# EAGLE schematic working (EAGLE 7.7.0)
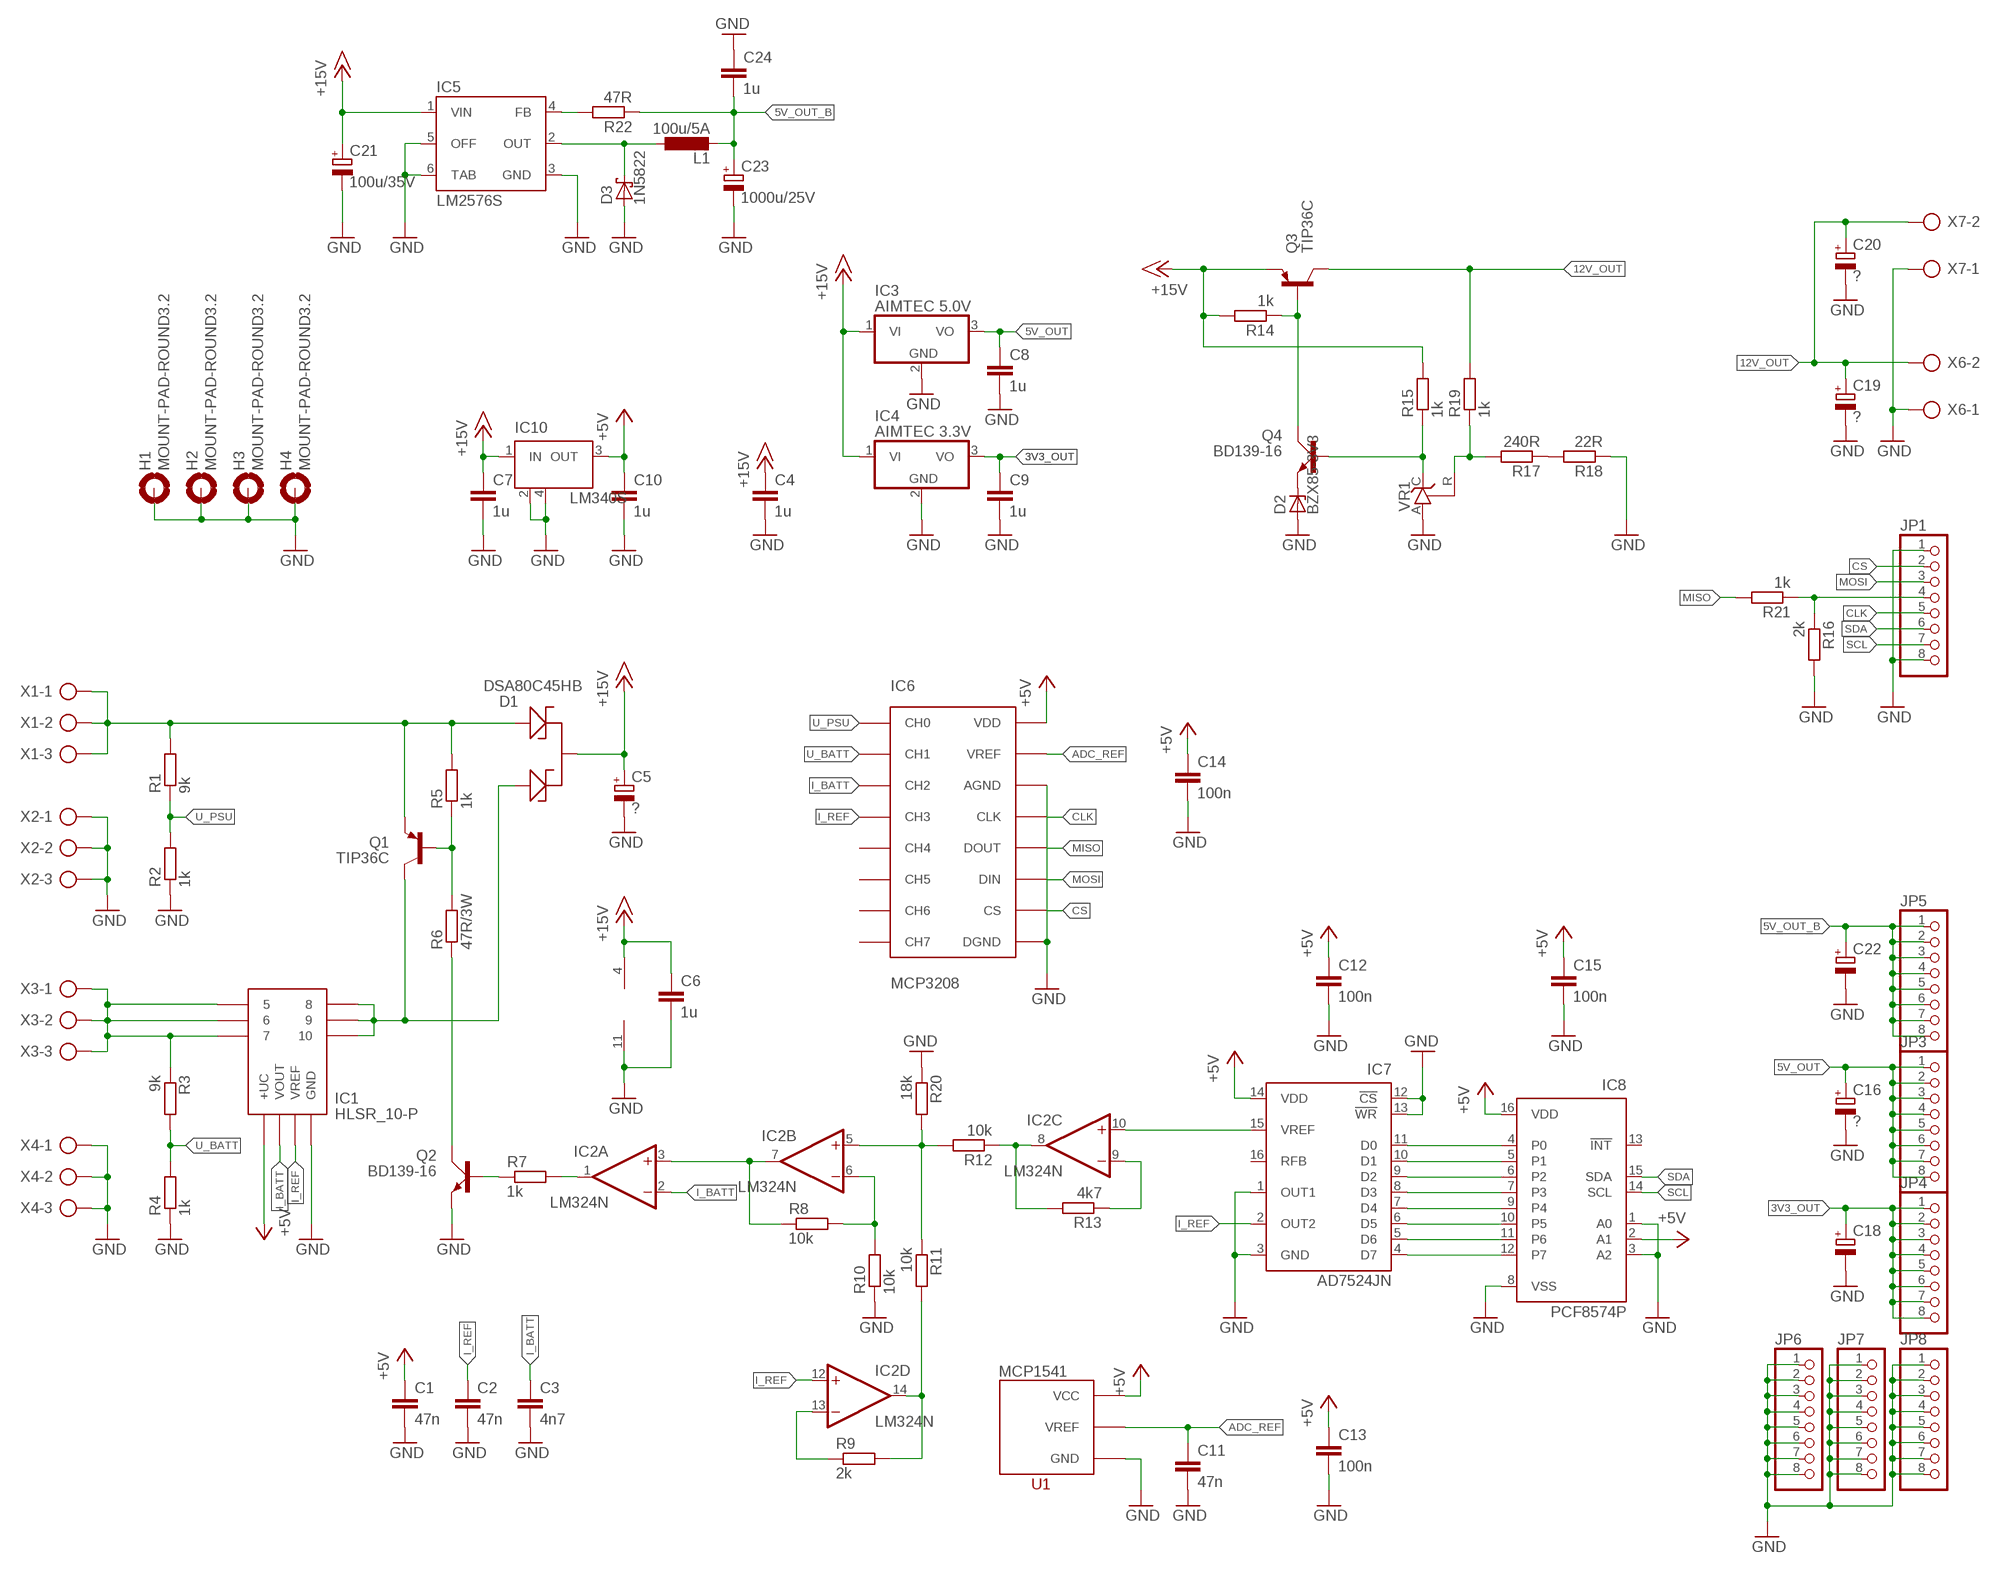
[diagram p0: schematic, sheet 1]

## Parts
C1  47n  C-EUC0805  [C0805]
C2  47n  C-EUC0805  [C0805]
C3  4n7  C-EUC0805  [C0805]
C4  1u  C-EUC0805  [C0805]
C5  ?  CPOL-EUE5-13  [E5-13]
C6  1u  C-EUC0805  [C0805]
C7  1u  C-EUC0805  [C0805]
C8  1u  C-EUC0805  [C0805]
C9  1u  C-EUC0805  [C0805]
C10  1u  C-EUC0805  [C0805]
C11  47n  C-EUC0805  [C0805]
C12  100n  C-EUC0805  [C0805]
C13  100n  C-EUC0805  [C0805]
C14  100n  C-EUC0805  [C0805]
C15  100n  C-EUC0805  [C0805]
C16  ?  CPOL-EUE2.5-6  [E2,5-6]
C18  CPOL-EUE2.5-6  [E2,5-6]
C19  ?  CPOL-EUE5-13  [E5-13]
C20  ?  CPOL-EUE5-13  [E5-13]
C21  100u/35V  CPOL-EUE5-10.5  [E5-10,5]
C22  CPOL-EUE2.5-6  [E2,5-6]
C23  1000u/25V  CPOL-EUE5-10.5  [E5-10,5]
C24  1u  C-EUC0805  [C0805]
D1  DSA80C45HB  [TO247BV]
D2  BZX85-3V3  BZX85  [DO41Z10]
D3  1N5822  1N5908  [C4111-15]
H1  MOUNT-PAD-ROUND3.2  [3,2-PAD]
H2  MOUNT-PAD-ROUND3.2  [3,2-PAD]
H3  MOUNT-PAD-ROUND3.2  [3,2-PAD]
H4  MOUNT-PAD-ROUND3.2  [3,2-PAD]
IC1  HLSR_10-P  [HLSR16-P]
IC2  LM324N  [DIL14]
IC3  AIMTEC 5.0V  7805TV  [TO220V]
IC4  AIMTEC 3.3V  7805TV  [TO220V]
IC5  LM2576S  [TO263-5]
IC6  MCP3208  [DIL16]
IC7  AD7524JN  [DIL16]
IC8  PCF8574P  [DIL16]
IC10  LM340S  [SOT223]
JP1  PINHD-1X8  [1X08]
JP3  PINHD-1X8  [1X08]
JP4  PINHD-1X8  [1X08]
JP5  PINHD-1X8  [1X08]
JP6  PINHD-1X8  [1X08]
JP7  PINHD-1X8  [1X08]
JP8  PINHD-1X8  [1X08]
L1  100u/5A  L-EUTJ5-U2  [TJ5-U2]
Q1  TIP36C  TIP36-V  [TO247-V]
Q2  BD139-16  BD139  [TO126AV]
Q3  TIP36C  TIP36-V  [TO247-V]
Q4  BD139-16  BD139  [TO126AV]
R1  9k  R-EU_R0805  [R0805]
R2  1k  R-EU_R0805  [R0805]
R3  9k  R-EU_R0805  [R0805]
R4  1k  R-EU_R0805  [R0805]
R5  1k  R-EU_R0805  [R0805]
R6  47R/3W  R-EU_0617/22  [0617/22]
R7  1k  R-EU_R0805  [R0805]
R8  10k  R-EU_R0805  [R0805]
R9  2k  R-EU_R0805  [R0805]
R10  10k  R-EU_R0805  [R0805]
R11  10k  R-EU_R0805  [R0805]
R12  10k  R-EU_R0805  [R0805]
R13  4k7  R-EU_R0805  [R0805]
R14  1k  R-EU_R0805  [R0805]
R15  1k  R-EU_R0805  [R0805]
R16  2k  R-EU_R0805  [R0805]
R17  240R  R-EU_R0805  [R0805]
R18  22R  R-EU_R0805  [R0805]
R19  1k  R-EU_R0805  [R0805]
R20  18k  R-EU_R0805  [R0805]
R21  1k  R-EU_R0805  [R0805]
R22  47R  R-EU_R0805  [R0805]
U1  VOLT_REFERENCE  [SOT23]
VR1  TL431CLP  [TO92-CLP]
X1  AK500/3  [AK500/3]
X2  AK500/3  [AK500/3]
X3  AK500/3  [AK500/3]
X4  AK500/3  [AK500/3]
X6  AK500/2  [AK500/2]
X7  AK500/2  [AK500/2]

## Nets
3V3_OUT: C9.1 C18.+ IC4.3(VO) JP4.1 JP4.2 JP4.3 JP4.4 JP4.5 JP4.6 JP4.7 JP4.8
5V_OUT: C8.1 C16.+ IC3.3(VO) JP3.1 JP3.2 JP3.3 JP3.4 JP3.5 JP3.6 JP3.7 JP3.8
5V_OUT_B: C22.+ C23.+ C24.2 JP5.1 JP5.2 JP5.3 JP5.4 JP5.5 JP5.6 JP5.7 JP5.8 L1.2 R22.1
12V_OUT: C19.+ C20.+ Q3.2(C) R19.2 X6.2 X7.2
+5V: C1.1 C10.1 C12.1 C13.1 C14.1 C15.1 IC1.4(+UC) IC6.VDD IC7.14(VDD) IC8.2(A1) IC8.16(VDD) IC10.3(OUT) U1.1(VCC)
+15V: C4.1 C5.+ C6.1 C7.1 C21.+ D1.2 IC2.4(P:V+) IC3.1(VI) IC4.1(VI) IC5.1(VIN) IC10.1(IN) Q3.3(E) R14.2 R15.2
ADC_REF: C11.1 IC6.VREF U1.2(VREF)
CLK: IC6.CLK JP1.5
CS: IC6.CS JP1.2
GND: C1.2 C2.2 C3.2 C4.2 C5.- C6.2 C7.2 C8.2 C9.2 C10.2 C11.2 C12.2 C13.2 C14.2 C15.2 C16.- C18.- C19.- C20.- C21.- C22.- C23.- C24.1 D2.A D3.A H1.B3,2(MOUNT) H2.B3,2(MOUNT) H3.B3,2(MOUNT) H4.B3,2(MOUNT) IC1.3(GND) IC2.11(P:V-) IC3.2(GND) IC4.2(GND) IC5.3(GND) IC5.5(OFF) IC5.6(TAB) IC6.AGND IC6.DGND IC7.1(OUT1) IC7.3(GND) IC7.12(!CS) IC7.13(!WR) IC8.1(A0) IC8.3(A2) IC8.8(VSS) IC10.2(GND) JP1.1 JP1.8 JP6.1 JP6.2 JP6.3 JP6.4 JP6.5 JP6.6 JP6.7 JP6.8 JP7.1 JP7.2 JP7.3 JP7.4 JP7.5 JP7.6 JP7.7 JP7.8 JP8.1 JP8.2 JP8.3 JP8.4 JP8.5 JP8.6 JP8.7 JP8.8 Q2.E R2.1 R4.1 R10.1 R16.2 R18.1 R20.1 U1.3(GND) VR1.A X2.1 X2.2 X2.3 X4.1 X4.2 X4.3 X6.1 X7.1
I_BATT: C3.1 IC1.2(VOUT) IC2.2(A:-IN) IC6.CH2
I_REF: C2.1 IC1.1(VREF) IC2.12(D:+IN) IC6.CH3 IC7.2(OUT2)
MISO: IC6.DOUT R21.2
MOSI: IC6.DIN JP1.3
N$1: IC1.5 IC1.6 IC1.7 R3.1 X3.1 X3.2 X3.3
N$2: D1.3 IC1.8 IC1.9 IC1.10 Q1.2(C)
N$3: Q1.1(B) R5.1 R6.2
N$4: Q2.C R6.1
N$5: IC2.6(B:-IN) R8.2 R10.2
N$6: D1.1 Q1.3(E) R1.2 R5.2 X1.1 X1.2 X1.3
N$7: Q2.B R7.1
N$8: IC2.1(A:OUT) R7.2
N$9: IC2.13(D:-IN) R9.1
N$10: IC2.3(A:+IN) IC2.7(B:OUT) R8.1
N$11: IC2.14(D:OUT) R9.2 R11.2
N$12: IC2.5(B:+IN) R11.1 R12.2 R20.2
N$13: IC2.8(C:OUT) R12.1 R13.2
N$14: IC7.11(D0) IC8.4(P0)
N$15: IC7.10(D1) IC8.5(P1)
N$16: IC7.9(D2) IC8.6(P2)
N$17: IC7.8(D3) IC8.7(P3)
N$18: Q3.1(B) Q4.C R14.1
N$19: IC7.7(D4) IC8.9(P4)
N$20: IC7.6(D5) IC8.10(P5)
N$21: IC7.5(D6) IC8.11(P6)
N$22: IC7.4(D7) IC8.12(P7)
N$23: Q4.B R15.1 VR1.C
N$24: D2.C Q4.E
N$25: IC2.9(C:-IN) R13.1
N$26: IC2.10(C:+IN) IC7.15(VREF)
N$27: JP1.4 R16.1 R21.1
N$30: R17.1 R18.2
N$31: IC5.4(FB) R22.2
N$32: R17.2 R19.1 VR1.R
N$33: D3.C IC5.2(OUT) L1.1
SCL: IC8.14(SCL) JP1.7
SDA: IC8.15(SDA) JP1.6
U_BATT: IC6.CH1 R3.2 R4.2
U_PSU: IC6.CH0 R1.1 R2.2
Unconnected: IC6.CH4 IC6.CH5 IC6.CH6 IC6.CH7 IC7.16(RFB) IC8.13(!INT)

## Power pins joined to a net without a drawn wire
GND: IC10.4(GND)

## Library data of the parts
C1-C4 C6-C15 C24 = rcl:C-EU: CAPACITOR, European symbol
C5 C16 C18-C23 = rcl:CPOL-EU: POLARIZED CAPACITOR, European symbol
D1 = DSA80C45HB:DSA80C45HB: DSA80C45HB
D2 = diode:BZX85: Z DIODE
D3 = diode:1N5908: DIODE schottky
H1-H4 = holes:MOUNT-PAD-ROUND: MOUNTING PAD, round
IC1 = HLSR_10-P:HLSR_10-P: LEM ASIC Open Loop Hall Effect Current Sensor, Maximum of 25 A, 10A output current Source: Datasheet <http://www.lem.com/docs/products/hlsr-p_series.pdf>; DESCRIPTION: LEM ASIC Open Loop Hall Effect Current Sensor, Maximum of 25 A, 10A output current; HEIGHT: mm; MANUFACTURER_NAME: LEM; MANUFACTURER_PART_NUMBER: HLSR 10-P; RS_PART_NUMBER: 7934584; RS_PRICE-STOCK: http://uk.rs-online.com/web/p/products/7934584
IC2 = linear:LM324: OP AMP
IC3 IC4 = linear:78*: Positive VOLTAGE REGULATOR Source: http://cache.national.com/ds/LM/LM78L05.pdf http://www.fairchildsemi.com/ds/LM/LM7805.pdf
IC5 = v-reg-3:LM2576: National Semiconductor <http://www.national.com> 3.0A "Simple Switcher"(c) 52kHz, Vout 1.23-37V (HV: 57V), Vin 40V (HV: 60V), 50µA standby current
IC6 = mcp3208:MCP3208
IC7 = analog-devices:AD7524*: 8-Bit Buffered Multiplying DAC Source: http://www.analog.com/UploadedFiles/Data_Sheets/888358036ad7524.pdf; MF: ALTERA CORPORATION; MPN: AD7524JNZ; OC_FARNELL: 9605401; OC_NEWARK: 59K4969
IC8 = micro-philips:PCF8574: I2C-Bus Remote 8-bit I/O expander http://www.semiconductors.philips.com/acrobat_download/datasheets/PCF8574_4.pdf; MPN: PCF8574PN; OC_FARNELL: 204020; OC_NEWARK: 11N8515
IC10 = linear:LM340S: 3-Terminal Positive Regulators Source: http://cache.national.com/ds/LM/LM340.pdf
JP1 JP3-JP8 = pinhead:PINHD-1X8: PIN HEADER
L1 = rcl:L-EU: INDUCTOR, European symbol
Q1 Q3 = transistor-pnp2:TIP36: PNP Power Transistor
Q2 Q4 = transistor-power:BD139: NPN TRANSISTOR
R1-R5 R7-R22 = resistor:R-EU_: RESISTOR, European symbol
R6 = rcl:R-EU_: RESISTOR, European symbol
U1 = icnh3:VOLT_REFERENCE
VR1 = v-reg:TL431CLP: VOLTAGE REGULATOR
X1-X4 = con-ptr500:AK500/3: CONNECTOR; OC_FARNELL: unknown; OC_NEWARK: unknown
X6 X7 = con-ptr500:AK500/2: CONNECTOR; OC_FARNELL: unknown; OC_NEWARK: unknown